# Altium schematic sheet JETSON.SchDoc
size D; SheetNumber: 2; SheetTotal: 8
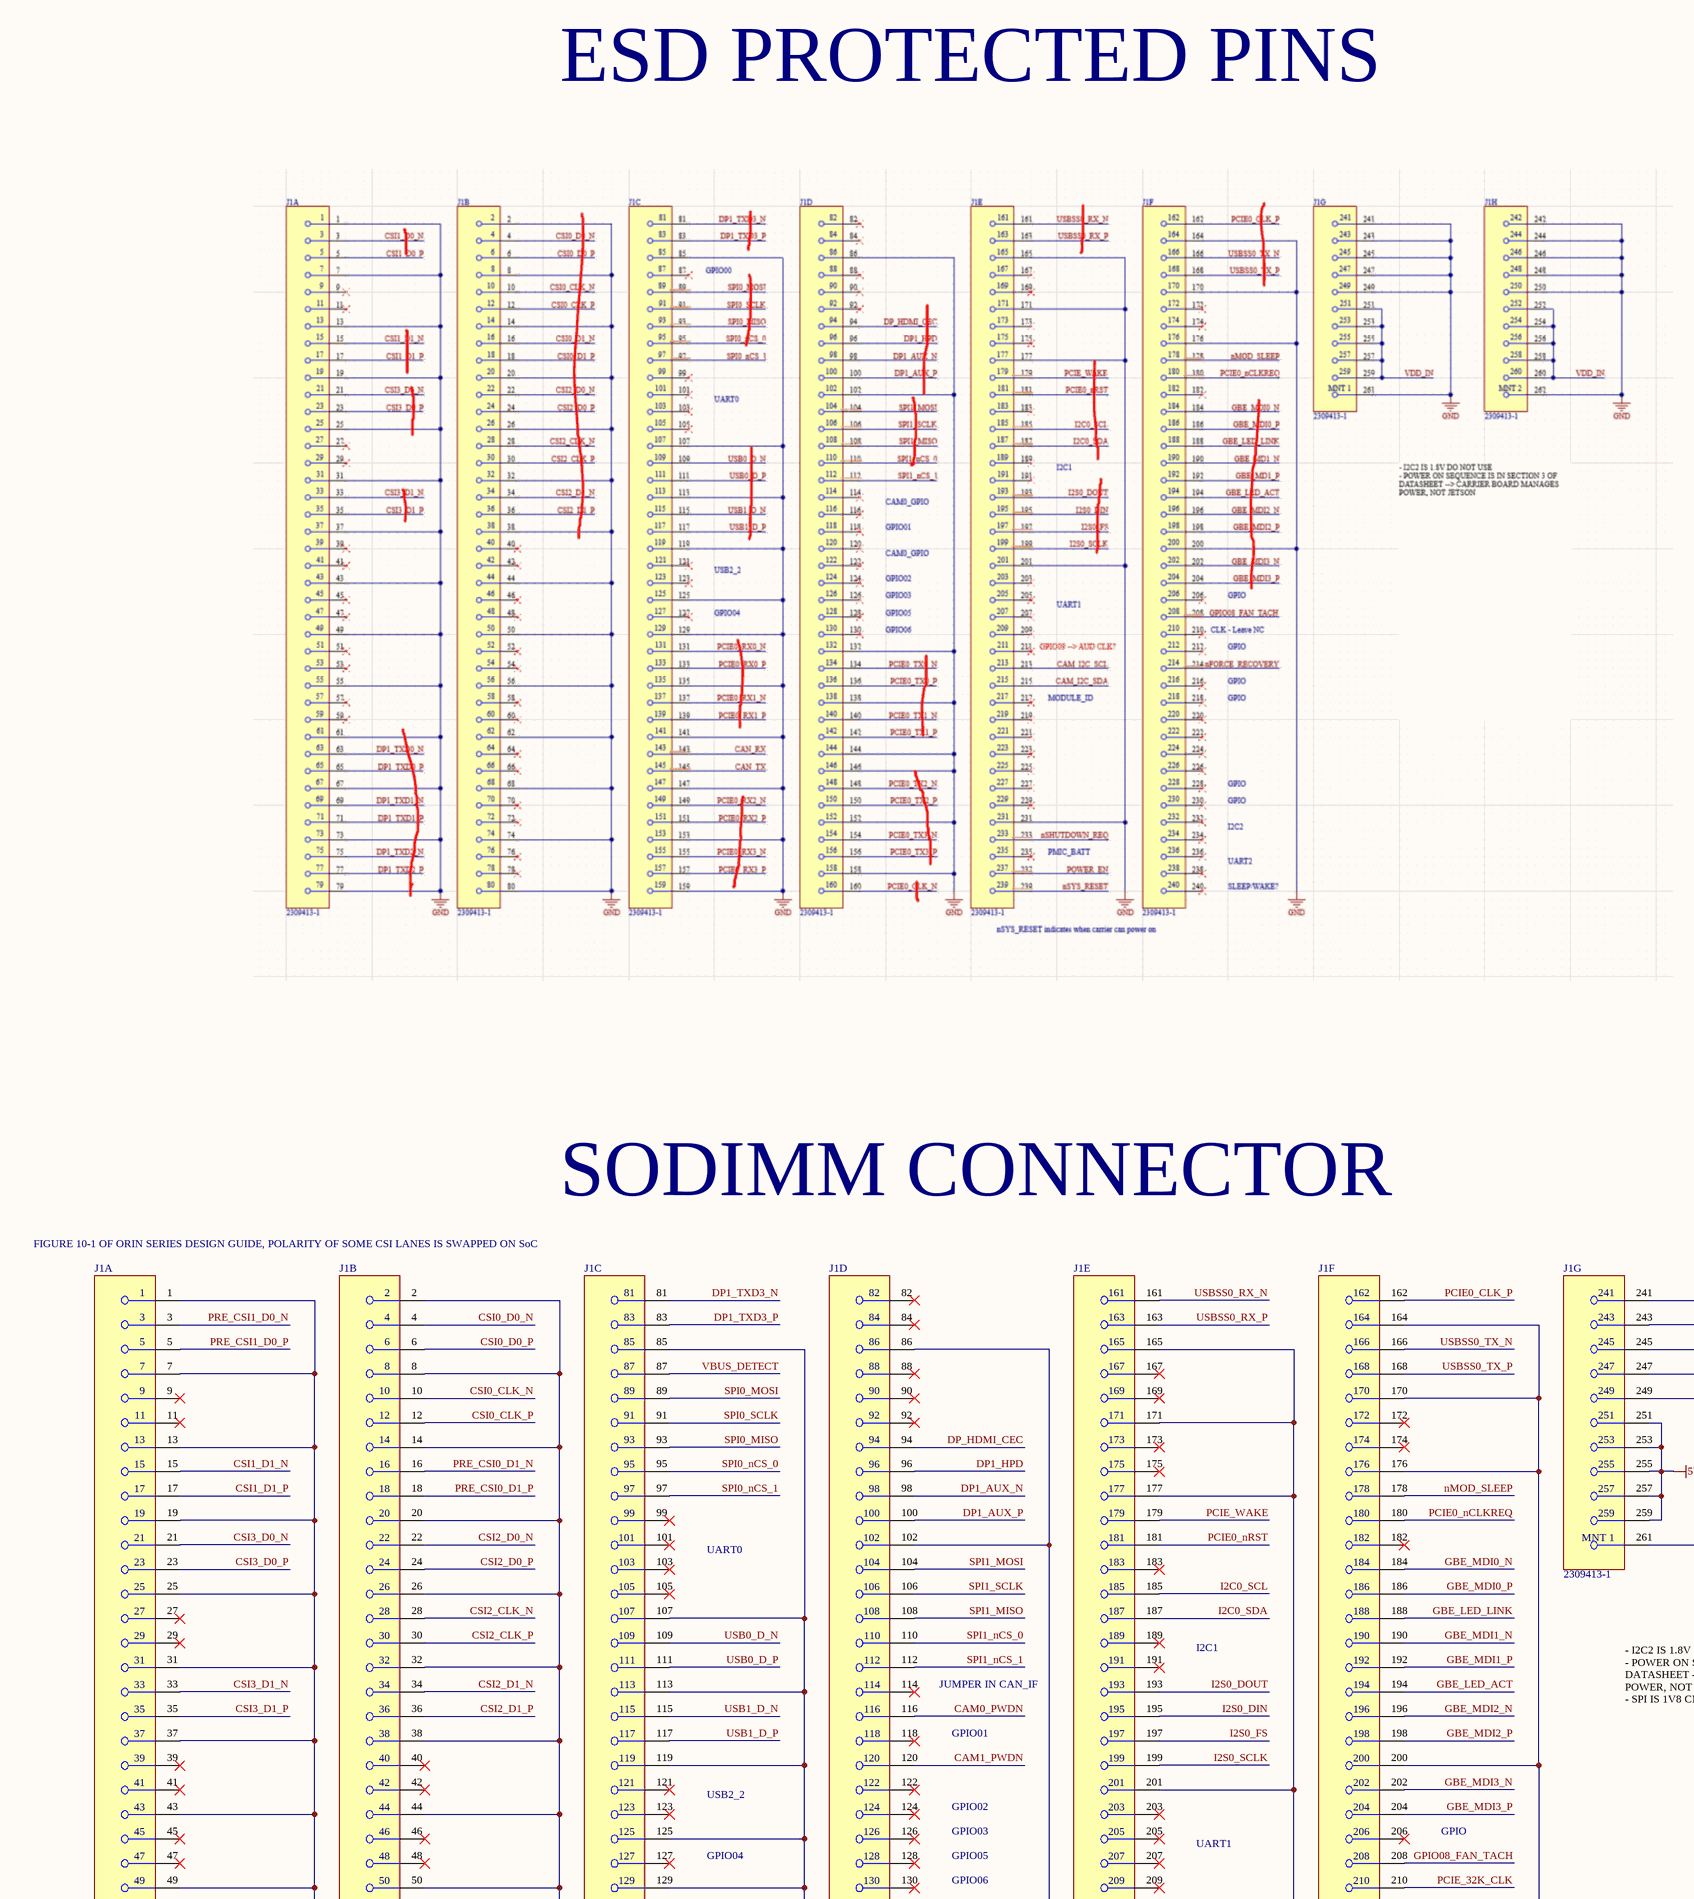
[diagram p0: JETSON.SchDoc, top left]
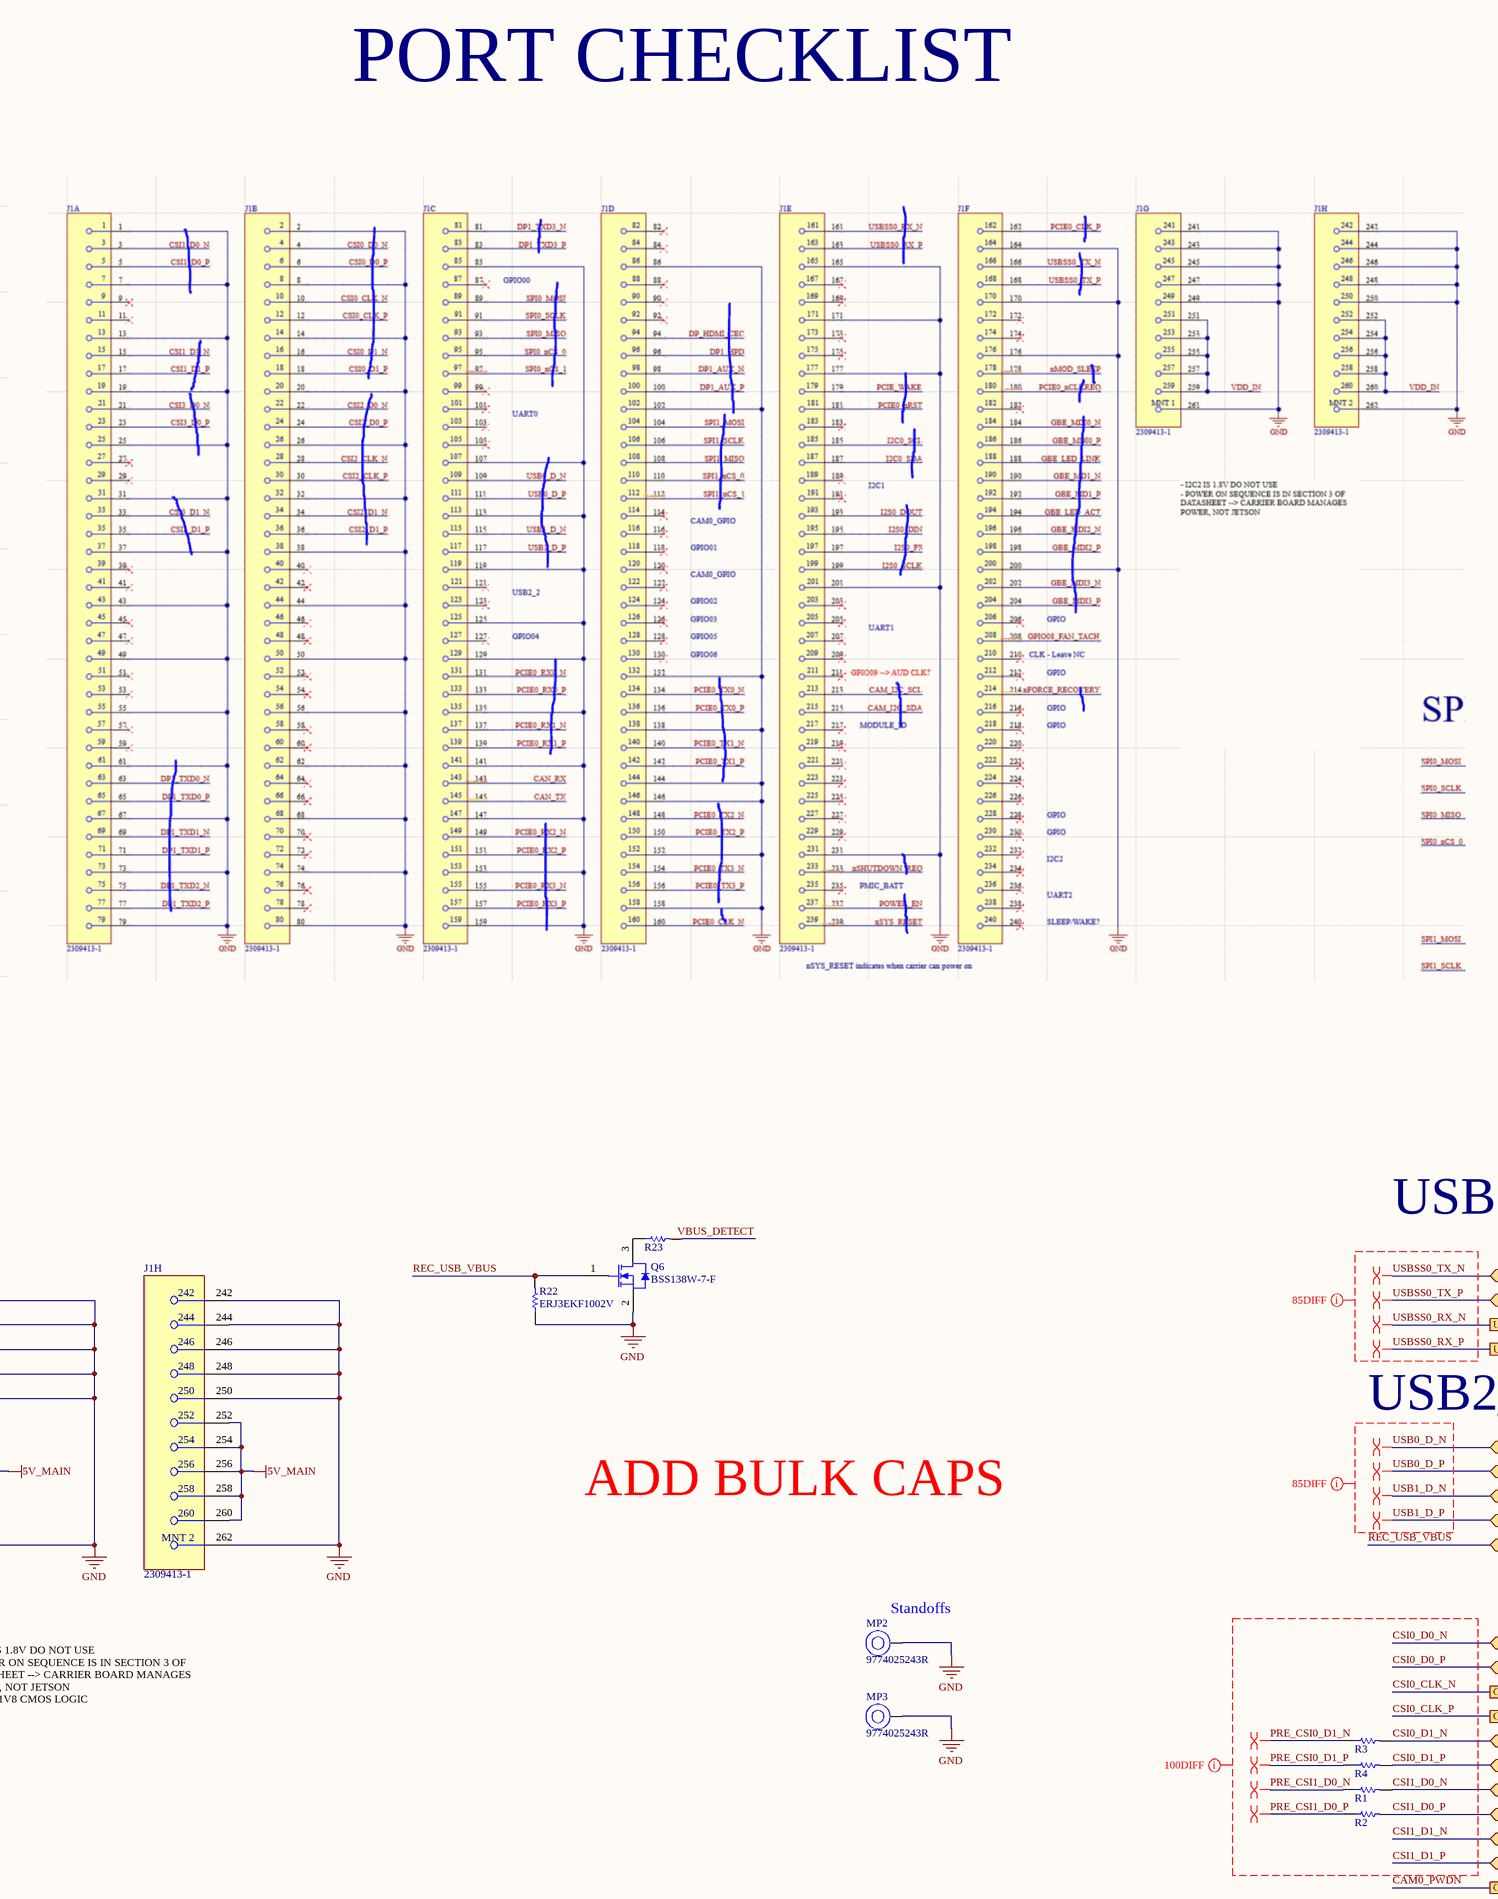
[diagram p1: JETSON.SchDoc, top middle]
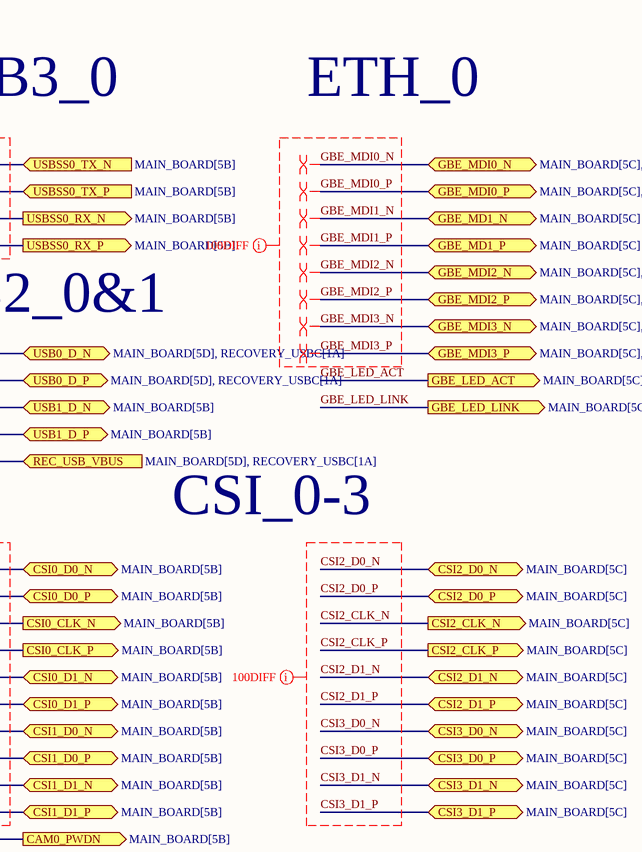
[diagram p2: JETSON.SchDoc, top right]
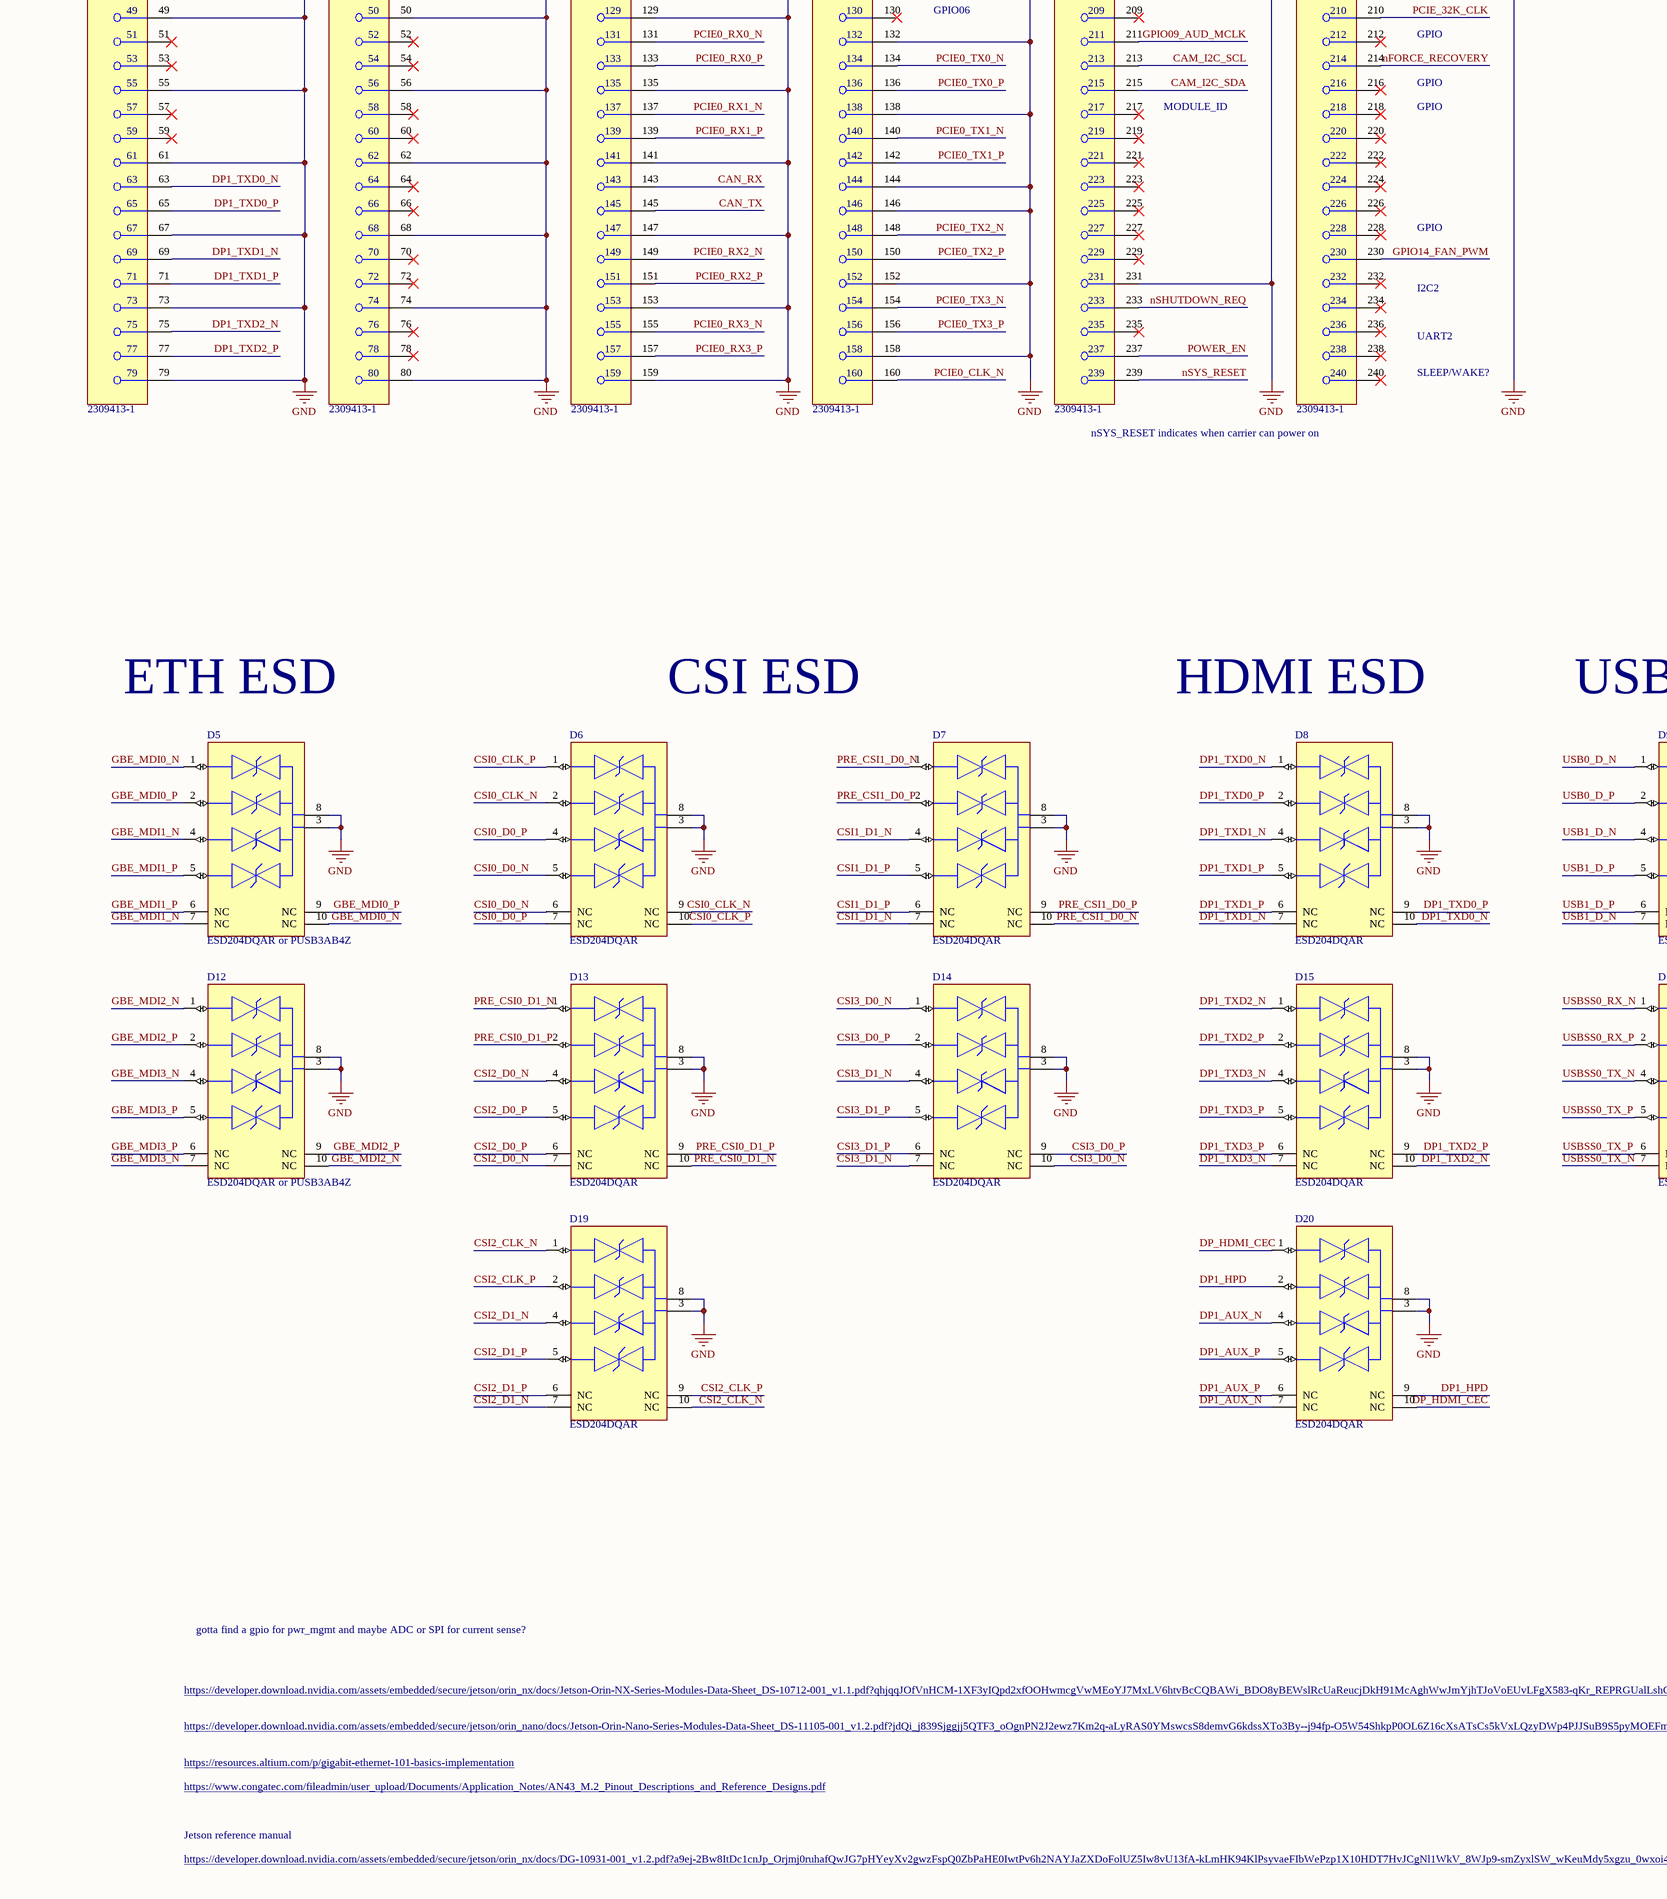
[diagram p3: JETSON.SchDoc, bottom left]
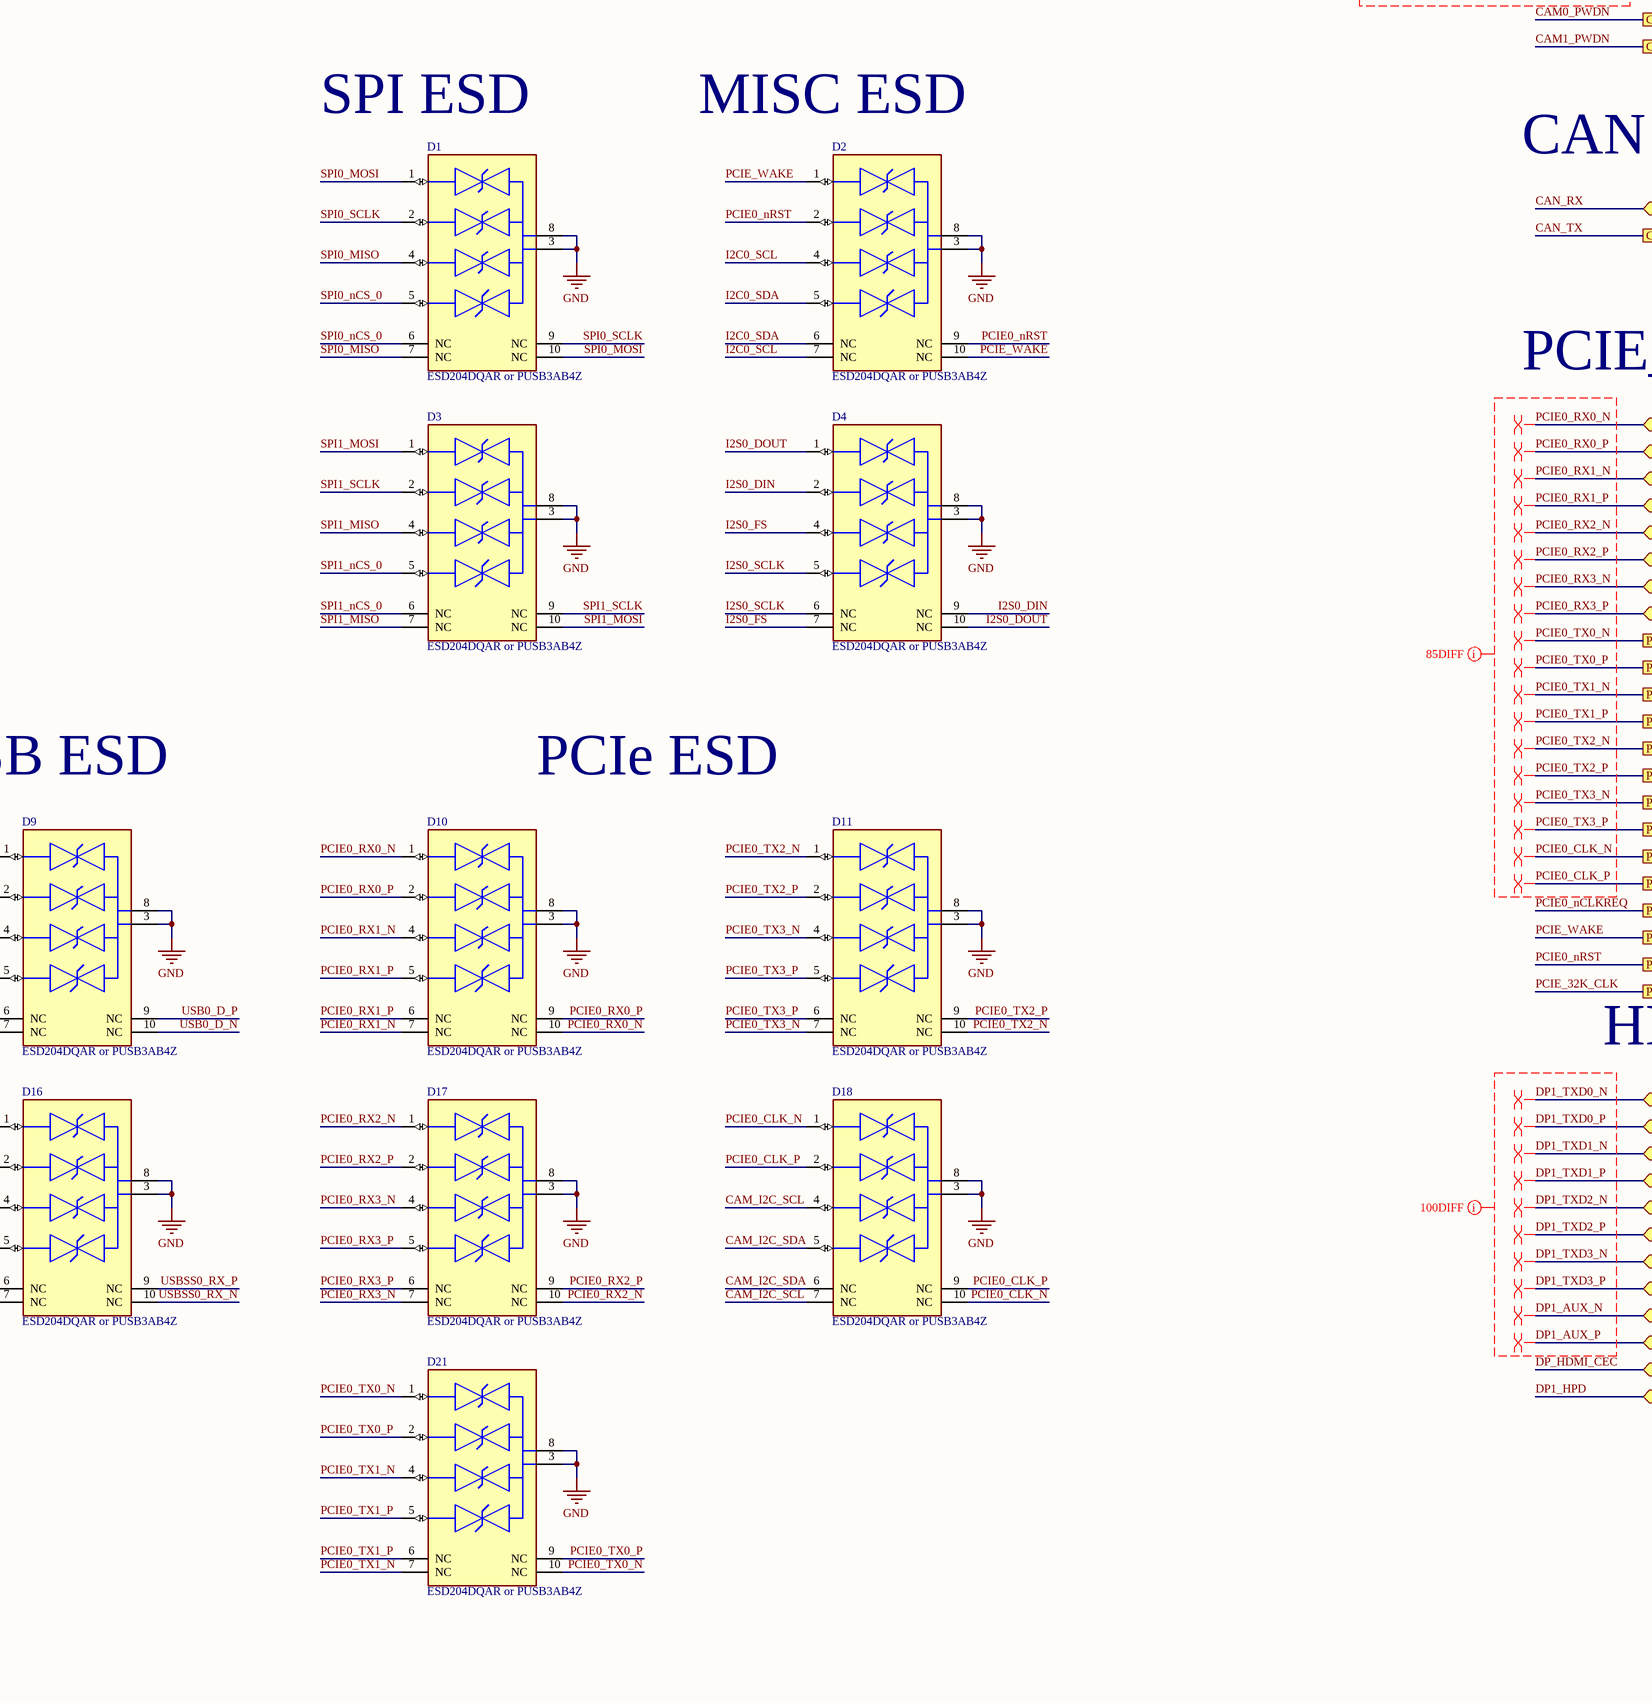
[diagram p4: JETSON.SchDoc, bottom middle]
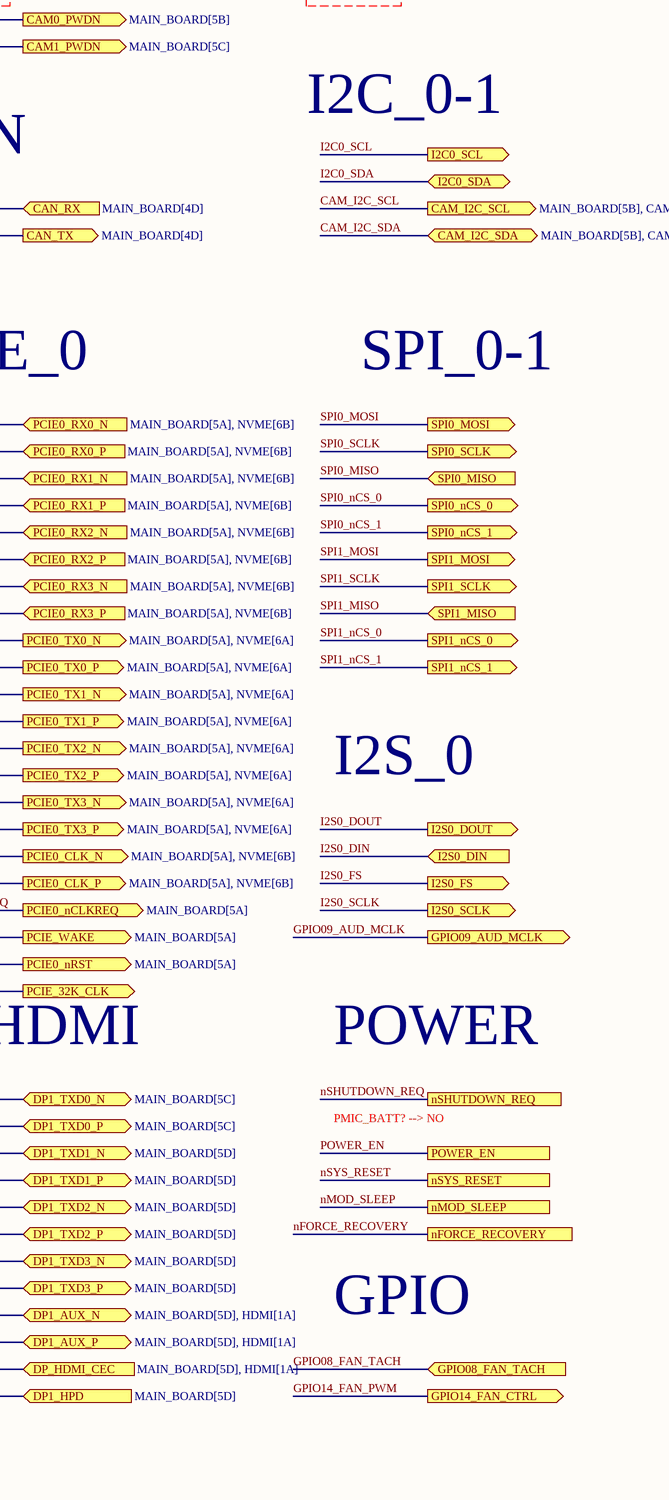
[diagram p5: JETSON.SchDoc, bottom right]

## Parts
D1  ESD204DQAR or PUSB3AB4Z  [FP-DQA0010A-MFG]
D2  ESD204DQAR or PUSB3AB4Z  [FP-DQA0010A-MFG]
D3  ESD204DQAR or PUSB3AB4Z  [FP-DQA0010A-MFG]
D4  ESD204DQAR or PUSB3AB4Z  [FP-DQA0010A-MFG]
D5  ESD204DQAR or PUSB3AB4Z  [FP-DQA0010A-MFG]
D6  ESD204DQAR  [FP-DQA0010A-MFG]
D7  ESD204DQAR  [FP-DQA0010A-MFG]
D8  ESD204DQAR  [FP-DQA0010A-MFG]
D9  ESD204DQAR or PUSB3AB4Z  [FP-DQA0010A-MFG]
D10  ESD204DQAR or PUSB3AB4Z  [FP-DQA0010A-MFG]
D11  ESD204DQAR or PUSB3AB4Z  [FP-DQA0010A-MFG]
D12  ESD204DQAR or PUSB3AB4Z  [FP-DQA0010A-MFG]
D13  ESD204DQAR  [FP-DQA0010A-MFG]
D14  ESD204DQAR  [FP-DQA0010A-MFG]
D15  ESD204DQAR  [FP-DQA0010A-MFG]
D16  ESD204DQAR or PUSB3AB4Z  [FP-DQA0010A-MFG]
D17  ESD204DQAR or PUSB3AB4Z  [FP-DQA0010A-MFG]
D18  ESD204DQAR or PUSB3AB4Z  [FP-DQA0010A-MFG]
D19  ESD204DQAR  [FP-DQA0010A-MFG]
D20  ESD204DQAR  [FP-DQA0010A-MFG]
D21  ESD204DQAR or PUSB3AB4Z  [FP-DQA0010A-MFG]
J1  2309413-1  [FP-2309413-1-MFG]  (parts A,B,C,D,E,F,G,H of 8)
MP2  9774025243R  [9774025243]
MP3  9774025243R  [9774025243]
Q6  BSS138W-7-F  [DIOD-SOT323-3_V]
R1  0402 JUMPER 0 OHM  [RESC1005X40X25NL05T05]  (value not drawn)
R2  0402 JUMPER 0 OHM  [RESC1005X40X25NL05T05]  (value not drawn)
R3  0402 JUMPER 0 OHM  [RESC1005X40X25NL05T05]  (value not drawn)
R4  0402 JUMPER 0 OHM  [RESC1005X40X25NL05T05]  (value not drawn)
R22  ERJ3EKF1002V  [RESC1609X55X30LL15T15]
R23  0402 JUMPER 0 OHM  [RESC1005X40X25NL05T05]  (value not drawn)

## Ports
CAM0_PWDN (out, see MAIN_BOARD[5B]), CAM1_PWDN (out, see MAIN_BOARD[5C]), CAM_I2C_SCL (out, see MAIN_BOARD[5B], CAMERA_INTERFACE[1B]), CAM_I2C_SDA (bidir, see MAIN_BOARD[5B], CAMERA_INTERFACE[1B]), CAN_RX (in, see MAIN_BOARD[4D]), CAN_TX (out, see MAIN_BOARD[4D]), CSI0_CLK_N (out, see MAIN_BOARD[5B]), CSI0_CLK_P (out, see MAIN_BOARD[5B]), CSI0_D0_N (bidir, see MAIN_BOARD[5B]), CSI0_D0_P (bidir, see MAIN_BOARD[5B]), CSI0_D1_N (bidir, see MAIN_BOARD[5B]), CSI0_D1_P (bidir, see MAIN_BOARD[5B]), CSI1_D0_N (bidir, see MAIN_BOARD[5B]), CSI1_D0_P (bidir, see MAIN_BOARD[5B]), CSI1_D1_N (bidir, see MAIN_BOARD[5B]), CSI1_D1_P (bidir, see MAIN_BOARD[5B]), CSI2_CLK_N (out, see MAIN_BOARD[5C]), CSI2_CLK_P (out, see MAIN_BOARD[5C]), CSI2_D0_N (bidir, see MAIN_BOARD[5C]), CSI2_D0_P (bidir, see MAIN_BOARD[5C]), CSI2_D1_N (bidir, see MAIN_BOARD[5C]), CSI2_D1_P (bidir, see MAIN_BOARD[5C]), CSI3_D0_N (bidir, see MAIN_BOARD[5C]), CSI3_D0_P (bidir, see MAIN_BOARD[5C]), CSI3_D1_N (bidir, see MAIN_BOARD[5C]), CSI3_D1_P (bidir, see MAIN_BOARD[5C]), DP1_AUX_N (bidir, see MAIN_BOARD[5D], HDMI[1A]), DP1_AUX_P (bidir, see MAIN_BOARD[5D], HDMI[1A]), DP1_HPD (in, see MAIN_BOARD[5D]), DP1_TXD0_N (bidir, see MAIN_BOARD[5C]), DP1_TXD0_P (bidir, see MAIN_BOARD[5C]), DP1_TXD1_N (bidir, see MAIN_BOARD[5D]), DP1_TXD1_P (bidir, see MAIN_BOARD[5D]), DP1_TXD2_N (bidir, see MAIN_BOARD[5D]), DP1_TXD2_P (bidir, see MAIN_BOARD[5D]), DP1_TXD3_N (bidir, see MAIN_BOARD[5D]), DP1_TXD3_P (bidir, see MAIN_BOARD[5D]), DP_HDMI_CEC (in, see MAIN_BOARD[5D], HDMI[1A]), GBE_LED_ACT (out, see MAIN_BOARD[5C], ETHERNET[1B]), GBE_LED_LINK (out, see MAIN_BOARD[5C], ETHERNET[1B]), GBE_MD1_N (bidir, see MAIN_BOARD[5C]), GBE_MD1_P (bidir, see MAIN_BOARD[5C]), GBE_MDI0_N (bidir, see MAIN_BOARD[5C], ETHERNET[1A]), GBE_MDI0_P (bidir, see MAIN_BOARD[5C], ETHERNET[1A]), GBE_MDI2_N (bidir, see MAIN_BOARD[5C], ETHERNET[1A]), GBE_MDI2_P (bidir, see MAIN_BOARD[5C], ETHERNET[1A]), GBE_MDI3_N (bidir, see MAIN_BOARD[5C], ETHERNET[1B]), GBE_MDI3_P (bidir, see MAIN_BOARD[5C], ETHERNET[1A]), GPIO08_FAN_TACH (in), GPIO09_AUD_MCLK (out), GPIO14_FAN_CTRL (out), I2C0_SCL (out), I2C0_SDA (bidir), I2S0_DIN (in), I2S0_DOUT (out), I2S0_FS (out), I2S0_SCLK (out), nFORCE_RECOVERY, nMOD_SLEEP, nSHUTDOWN_REQ, nSYS_RESET, PCIE0_CLK_N (out, see MAIN_BOARD[5A], NVME[6B]), PCIE0_CLK_P (out, see MAIN_BOARD[5A], NVME[6B]), PCIE0_nCLKREQ (out, see MAIN_BOARD[5A]), PCIE0_nRST (out, see MAIN_BOARD[5A]), PCIE0_RX0_N (in, see MAIN_BOARD[5A], NVME[6B]), PCIE0_RX0_P (in, see MAIN_BOARD[5A], NVME[6B]), PCIE0_RX1_N (in, see MAIN_BOARD[5A], NVME[6B]), PCIE0_RX1_P (in, see MAIN_BOARD[5A], NVME[6B]), PCIE0_RX2_N (in, see MAIN_BOARD[5A], NVME[6B]), PCIE0_RX2_P (in, see MAIN_BOARD[5A], NVME[6B]), PCIE0_RX3_N (in, see MAIN_BOARD[5A], NVME[6B]), PCIE0_RX3_P (in, see MAIN_BOARD[5A], NVME[6B]), PCIE0_TX0_N (out, see MAIN_BOARD[5A], NVME[6A]), PCIE0_TX0_P (out, see MAIN_BOARD[5A], NVME[6A]), PCIE0_TX1_N (out, see MAIN_BOARD[5A], NVME[6A]), PCIE0_TX1_P (out, see MAIN_BOARD[5A], NVME[6A]), PCIE0_TX2_N (out, see MAIN_BOARD[5A], NVME[6A]), PCIE0_TX2_P (out, see MAIN_BOARD[5A], NVME[6A]), PCIE0_TX3_N (out, see MAIN_BOARD[5A], NVME[6A]), PCIE0_TX3_P (out, see MAIN_BOARD[5A], NVME[6A]), PCIE_32K_CLK (out), PCIE_WAKE (out, see MAIN_BOARD[5A]), POWER_EN, REC_USB_VBUS (in, see MAIN_BOARD[5D], RECOVERY_USBC[1A]), SPI0_MISO (in), SPI0_MOSI (out), SPI0_nCS_0 (out), SPI0_nCS_1 (out), SPI0_SCLK (out), SPI1_MISO (in), SPI1_MOSI (out), SPI1_nCS_0 (out), SPI1_nCS_1 (out), SPI1_SCLK (out), USB0_D_N (bidir, see MAIN_BOARD[5D], RECOVERY_USBC[1A]), USB0_D_P (bidir, see MAIN_BOARD[5D], RECOVERY_USBC[1A]), USB1_D_N (bidir, see MAIN_BOARD[5B]), USB1_D_P (bidir, see MAIN_BOARD[5B]), USBSS0_RX_N (out, see MAIN_BOARD[5B]), USBSS0_RX_P (out, see MAIN_BOARD[5B]), USBSS0_TX_N (in, see MAIN_BOARD[5B]), USBSS0_TX_P (in, see MAIN_BOARD[5B])

## Nets
5V_MAIN: J1.251 J1.252 J1.253 J1.254 J1.255 J1.256 J1.257 J1.258 J1.259 J1.260
GND: D1.3(GND) D1.8(GND) D2.3(GND) D2.8(GND) D3.3(GND) D3.8(GND) D4.3(GND) D4.8(GND) D5.3(GND) D5.8(GND) D6.3(GND) D6.8(GND) D7.3(GND) D7.8(GND) D8.3(GND) D8.8(GND) D9.3(GND) D9.8(GND) D10.3(GND) D10.8(GND) D11.3(GND) D11.8(GND) D12.3(GND) D12.8(GND) D13.3(GND) D13.8(GND) D14.3(GND) D14.8(GND) D15.3(GND) D15.8(GND) D16.3(GND) D16.8(GND) D17.3(GND) D17.8(GND) D18.3(GND) D18.8(GND) D19.3(GND) D19.8(GND) D20.3(GND) D20.8(GND) D21.3(GND) D21.8(GND) J1.1 J1.2 J1.7 J1.8 J1.13 J1.14 J1.19 J1.20 J1.25 J1.26 J1.31 J1.32 J1.37 J1.38 J1.43 J1.44 J1.49 J1.50 J1.55 J1.56 J1.61 J1.62 J1.67 J1.68 J1.73 J1.74 J1.79 J1.80 J1.85 J1.86 J1.102 J1.107 J1.113 J1.119 J1.125 J1.129 J1.132 J1.135 J1.138 J1.141 J1.144 J1.146 J1.147 J1.152 J1.153 J1.158 J1.159 J1.164 J1.165 J1.170 J1.171 J1.176 J1.177 J1.200 J1.201 J1.231 J1.241 J1.242 J1.243 J1.244 J1.245 J1.246 J1.247 J1.248 J1.249 J1.250 J1.261(MNT_1) J1.262(MNT_2) MP2.1 MP3.1 Q6.2(S) R22.1
CAM0_PWDN: J1.116 ; port CAM0_PWDN
CAM1_PWDN: J1.120 ; port CAM1_PWDN
CAM_I2C_SCL: D18.4(IO3) D18.7(NC) J1.213 ; port CAM_I2C_SCL
CAM_I2C_SDA: D18.5(IO4) D18.6(NC) J1.215 ; port CAM_I2C_SDA
CAN_RX: J1.143 ; port CAN_RX
CAN_TX: J1.145 ; port CAN_TX
CSI0_CLK_N: D6.2(IO2) D6.9(NC) J1.10 ; port CSI0_CLK_N
CSI0_CLK_P: D6.1(IO1) D6.10(NC) J1.12 ; port CSI0_CLK_P
CSI0_D0_N: D6.5(IO4) D6.6(NC) J1.4 ; port CSI0_D0_N
CSI0_D0_P: D6.4(IO3) D6.7(NC) J1.6 ; port CSI0_D0_P
CSI0_D1_N: R3.2 ; port CSI0_D1_N
CSI0_D1_P: R4.2 ; port CSI0_D1_P
CSI1_D0_N: R1.2 ; port CSI1_D0_N
CSI1_D0_P: R2.2 ; port CSI1_D0_P
CSI1_D1_N: D7.4(IO3) D7.7(NC) J1.15 ; port CSI1_D1_N
CSI1_D1_P: D7.5(IO4) D7.6(NC) J1.17 ; port CSI1_D1_P
CSI2_CLK_N: D19.1(IO1) D19.10(NC) J1.28 ; port CSI2_CLK_N
CSI2_CLK_P: D19.2(IO2) D19.9(NC) J1.30 ; port CSI2_CLK_P
CSI2_D0_N: D13.4(IO3) D13.7(NC) J1.22 ; port CSI2_D0_N
CSI2_D0_P: D13.5(IO4) D13.6(NC) J1.24 ; port CSI2_D0_P
CSI2_D1_N: D19.4(IO3) D19.7(NC) J1.34 ; port CSI2_D1_N
CSI2_D1_P: D19.5(IO4) D19.6(NC) J1.36 ; port CSI2_D1_P
CSI3_D0_N: D14.1(IO1) D14.10(NC) J1.21 ; port CSI3_D0_N
CSI3_D0_P: D14.2(IO2) D14.9(NC) J1.23 ; port CSI3_D0_P
CSI3_D1_N: D14.4(IO3) D14.7(NC) J1.33 ; port CSI3_D1_N
CSI3_D1_P: D14.5(IO4) D14.6(NC) J1.35 ; port CSI3_D1_P
DP1_AUX_N: D20.4(IO3) D20.7(NC) J1.98 ; port DP1_AUX_N
DP1_AUX_P: D20.5(IO4) D20.6(NC) J1.100 ; port DP1_AUX_P
DP1_HPD: D20.2(IO2) D20.9(NC) J1.96 ; port DP1_HPD
DP1_TXD0_N: D8.1(IO1) D8.10(NC) J1.63 ; port DP1_TXD0_N
DP1_TXD0_P: D8.2(IO2) D8.9(NC) J1.65 ; port DP1_TXD0_P
DP1_TXD1_N: D8.4(IO3) D8.7(NC) J1.69 ; port DP1_TXD1_N
DP1_TXD1_P: D8.5(IO4) D8.6(NC) J1.71 ; port DP1_TXD1_P
DP1_TXD2_N: D15.1(IO1) D15.10(NC) J1.75 ; port DP1_TXD2_N
DP1_TXD2_P: D15.2(IO2) D15.9(NC) J1.77 ; port DP1_TXD2_P
DP1_TXD3_N: D15.4(IO3) D15.7(NC) J1.81 ; port DP1_TXD3_N
DP1_TXD3_P: D15.5(IO4) D15.6(NC) J1.83 ; port DP1_TXD3_P
DP_HDMI_CEC: D20.1(IO1) D20.10(NC) J1.94 ; port DP_HDMI_CEC
GBE_LED_ACT: J1.194 ; port GBE_LED_ACT
GBE_LED_LINK: J1.188 ; port GBE_LED_LINK
GBE_MDI0_N: D5.1(IO1) D5.10(NC) J1.184 ; port GBE_MDI0_N
GBE_MDI0_P: D5.2(IO2) D5.9(NC) J1.186 ; port GBE_MDI0_P
GBE_MDI1_N: D5.4(IO3) D5.7(NC) J1.190 ; port GBE_MD1_N
GBE_MDI1_P: D5.5(IO4) D5.6(NC) J1.192 ; port GBE_MD1_P
GBE_MDI2_N: D12.1(IO1) D12.10(NC) J1.196 ; port GBE_MDI2_N
GBE_MDI2_P: D12.2(IO2) D12.9(NC) J1.198 ; port GBE_MDI2_P
GBE_MDI3_N: D12.4(IO3) D12.7(NC) J1.202 ; port GBE_MDI3_N
GBE_MDI3_P: D12.5(IO4) D12.6(NC) J1.204 ; port GBE_MDI3_P
GPIO08_FAN_TACH: J1.208 ; port GPIO08_FAN_TACH
GPIO09_AUD_MCLK: J1.211 ; port GPIO09_AUD_MCLK
GPIO14_FAN_PWM: J1.230 ; port GPIO14_FAN_CTRL
I2C0_SCL: D2.4(IO3) D2.7(NC) J1.185 ; port I2C0_SCL
I2C0_SDA: D2.5(IO4) D2.6(NC) J1.187 ; port I2C0_SDA
I2S0_DIN: D4.2(IO2) D4.9(NC) J1.195 ; port I2S0_DIN
I2S0_DOUT: D4.1(IO1) D4.10(NC) J1.193 ; port I2S0_DOUT
I2S0_FS: D4.4(IO3) D4.7(NC) J1.197 ; port I2S0_FS
I2S0_SCLK: D4.5(IO4) D4.6(NC) J1.199 ; port I2S0_SCLK
nFORCE_RECOVERY: J1.214 ; port nFORCE_RECOVERY
nMOD_SLEEP: J1.178 ; port nMOD_SLEEP
nSHUTDOWN_REQ: J1.233 ; port nSHUTDOWN_REQ
nSYS_RESET: J1.239 ; port nSYS_RESET
PCIE0_CLK_N: D18.1(IO1) D18.10(NC) J1.160 ; port PCIE0_CLK_N
PCIE0_CLK_P: D18.2(IO2) D18.9(NC) J1.162 ; port PCIE0_CLK_P
PCIE0_nCLKREQ: J1.180 ; port PCIE0_nCLKREQ
PCIE0_nRST: D2.2(IO2) D2.9(NC) J1.181 ; port PCIE0_nRST
PCIE0_RX0_N: D10.1(IO1) D10.10(NC) J1.131 ; port PCIE0_RX0_N
PCIE0_RX0_P: D10.2(IO2) D10.9(NC) J1.133 ; port PCIE0_RX0_P
PCIE0_RX1_N: D10.4(IO3) D10.7(NC) J1.137 ; port PCIE0_RX1_N
PCIE0_RX1_P: D10.5(IO4) D10.6(NC) J1.139 ; port PCIE0_RX1_P
PCIE0_RX2_N: D17.1(IO1) D17.10(NC) J1.149 ; port PCIE0_RX2_N
PCIE0_RX2_P: D17.2(IO2) D17.9(NC) J1.151 ; port PCIE0_RX2_P
PCIE0_RX3_N: D17.4(IO3) D17.7(NC) J1.155 ; port PCIE0_RX3_N
PCIE0_RX3_P: D17.5(IO4) D17.6(NC) J1.157 ; port PCIE0_RX3_P
PCIE0_TX0_N: D21.1(IO1) D21.10(NC) J1.134 ; port PCIE0_TX0_N
PCIE0_TX0_P: D21.2(IO2) D21.9(NC) J1.136 ; port PCIE0_TX0_P
PCIE0_TX1_N: D21.4(IO3) D21.7(NC) J1.140 ; port PCIE0_TX1_N
PCIE0_TX1_P: D21.5(IO4) D21.6(NC) J1.142 ; port PCIE0_TX1_P
PCIE0_TX2_N: D11.1(IO1) D11.10(NC) J1.148 ; port PCIE0_TX2_N
PCIE0_TX2_P: D11.2(IO2) D11.9(NC) J1.150 ; port PCIE0_TX2_P
PCIE0_TX3_N: D11.4(IO3) D11.7(NC) J1.154 ; port PCIE0_TX3_N
PCIE0_TX3_P: D11.5(IO4) D11.6(NC) J1.156 ; port PCIE0_TX3_P
PCIE_32K_CLK: J1.210 ; port PCIE_32K_CLK
PCIE_WAKE: D2.1(IO1) D2.10(NC) J1.179 ; port PCIE_WAKE
POWER_EN: J1.237 ; port POWER_EN
PRE_CSI0_D1_N: D13.1(IO1) D13.10(NC) J1.16 R3.1
PRE_CSI0_D1_P: D13.2(IO2) D13.9(NC) J1.18 R4.1
PRE_CSI1_D0_N: D7.1(IO1) D7.10(NC) J1.3 R1.1
PRE_CSI1_D0_P: D7.2(IO2) D7.9(NC) J1.5 R2.1
REC_USB_VBUS: Q6.1(G) R22.2 ; port REC_USB_VBUS
SPI0_MISO: D1.4(IO3) D1.7(NC) J1.93 ; port SPI0_MISO
SPI0_MOSI: D1.1(IO1) D1.10(NC) J1.89 ; port SPI0_MOSI
SPI0_nCS_0: D1.5(IO4) D1.6(NC) J1.95 ; port SPI0_nCS_0
SPI0_nCS_1: J1.97 ; port SPI0_nCS_1
SPI0_SCLK: D1.2(IO2) D1.9(NC) J1.91 ; port SPI0_SCLK
SPI1_MISO: D3.4(IO3) D3.7(NC) J1.108 ; port SPI1_MISO
SPI1_MOSI: D3.1(IO1) D3.10(NC) J1.104 ; port SPI1_MOSI
SPI1_nCS_0: D3.5(IO4) D3.6(NC) J1.110 ; port SPI1_nCS_0
SPI1_nCS_1: J1.112 ; port SPI1_nCS_1
SPI1_SCLK: D3.2(IO2) D3.9(NC) J1.106 ; port SPI1_SCLK
USB0_D_N: D9.1(IO1) D9.10(NC) J1.109 ; port USB0_D_N
USB0_D_P: D9.2(IO2) D9.9(NC) J1.111 ; port USB0_D_P
USB1_D_N: D9.4(IO3) D9.7(NC) J1.115 ; port USB1_D_N
USB1_D_P: D9.5(IO4) D9.6(NC) J1.117 ; port USB1_D_P
USBSS0_RX_N: D16.1(IO1) D16.10(NC) J1.161 ; port USBSS0_RX_N
USBSS0_RX_P: D16.2(IO2) D16.9(NC) J1.163 ; port USBSS0_RX_P
USBSS0_TX_N: D16.4(IO3) D16.7(NC) J1.166 ; port USBSS0_TX_N
USBSS0_TX_P: D16.5(IO4) D16.6(NC) J1.168 ; port USBSS0_TX_P
VBUS_DETECT: J1.87 R23.2
NetQ6_3: Q6.3(D) R23.1

Not connected (* = marked no-connect by the designer): J1 9* 11* 27* 29* 39* 40* 41* 42* 45* 46* 47* 48* 51* 52* 53* 54* 57* 58* 59* 60* 64* 66* 70* 72* 76* 78* 82* 84* 88* 90* 92* 99* 101* 103* 105* 114* 118* 121* 122* 123* 124* 126* 127* 128* 130* 167* 169* 172* 173* 174* 175* 182* 183* 189* 191* 203* 205* 206* 207* 209* 212* 216* 217* 218* 219* 220* 221* 222* 223* 224* 225* 226* 227* 228* 229* 232* 234* 235* 236* 238* 240*

## Layout directives
net class 85DIFF: PCIE0_CLK_N, PCIE0_CLK_P, PCIE0_RX0_N, PCIE0_RX0_P, PCIE0_RX1_N, PCIE0_RX1_P, PCIE0_RX2_N, PCIE0_RX2_P, PCIE0_RX3_N, PCIE0_RX3_P, PCIE0_TX0_N, PCIE0_TX0_P, PCIE0_TX1_N, PCIE0_TX1_P, PCIE0_TX2_N, PCIE0_TX2_P, PCIE0_TX3_N, PCIE0_TX3_P, USB0_D_N, USB0_D_P, USB1_D_N, USB1_D_P, USBSS0_RX_N, USBSS0_RX_P, USBSS0_TX_N, USBSS0_TX_P
net class 100DIFF: CSI0_CLK_N, CSI0_CLK_P, CSI0_D0_N, CSI0_D0_P, CSI0_D1_N, CSI0_D1_P, CSI1_D0_N, CSI1_D0_P, CSI1_D1_N, CSI1_D1_P, CSI2_CLK_N, CSI2_CLK_P, CSI2_D0_N, CSI2_D0_P, CSI2_D1_N, CSI2_D1_P, CSI3_D0_N, CSI3_D0_P, CSI3_D1_N, CSI3_D1_P, DP1_AUX_N, DP1_AUX_P, DP1_TXD0_N, DP1_TXD0_P, DP1_TXD1_N, DP1_TXD1_P, DP1_TXD2_N, DP1_TXD2_P, DP1_TXD3_N, DP1_TXD3_P, GBE_MDI0_N, GBE_MDI0_P, GBE_MDI1_N, GBE_MDI1_P, GBE_MDI2_N, GBE_MDI2_P, GBE_MDI3_N, GBE_MDI3_P, PRE_CSI0_D1_N, PRE_CSI0_D1_P, PRE_CSI1_D0_N, PRE_CSI1_D0_P
differential pair: DP1_AUX_N, DP1_AUX_P, DP1_TXD0_N, DP1_TXD0_P, DP1_TXD1_N, DP1_TXD1_P, DP1_TXD2_N, DP1_TXD2_P, DP1_TXD3_N, DP1_TXD3_P, GBE_MDI0_N, GBE_MDI0_P, GBE_MDI1_N, GBE_MDI1_P, GBE_MDI2_N, GBE_MDI2_P, GBE_MDI3_N, GBE_MDI3_P, PCIE0_CLK_N, PCIE0_CLK_P, PCIE0_RX0_N, PCIE0_RX0_P, PCIE0_RX1_N, PCIE0_RX1_P, PCIE0_RX2_N, PCIE0_RX2_P, PCIE0_RX3_N, PCIE0_RX3_P, PCIE0_TX0_N, PCIE0_TX0_P, PCIE0_TX1_N, PCIE0_TX1_P, PCIE0_TX2_N, PCIE0_TX2_P, PCIE0_TX3_N, PCIE0_TX3_P, PRE_CSI0_D1_N, PRE_CSI0_D1_P, PRE_CSI1_D0_N, PRE_CSI1_D0_P, USB0_D_N, USB0_D_P, USB1_D_N, USB1_D_P, USBSS0_RX_N, USBSS0_RX_P, USBSS0_TX_N, USBSS0_TX_P

## Notes on the sheet
- ESD PROTECTED PINS
- PORT CHECKLIST
- SODIMM CONNECTOR
- USB3_0
- ETH_0
- FIGURE 10-1 OF ORIN SERIES DESIGN GUIDE, POLARITY OF SOME CSI LANES IS SWAPPED ON SoC
- USB2_0&1
- ADD BULK CAPS
- UART0
- CSI_0-3
- I2C1
- (near MP2) Standoffs
- JUMPER IN CAN_IF
- GPIO01
- USB2_2
- GPIO02
- GPIO03
- UART1
- GPIO
- GPIO04
- GPIO05
- GPIO06
- MODULE_ID
- - I2C2 IS 1.8V DO NOT USE
  - POWER ON SEQUENCE IS IN SECTION 3 OF DATASHEET --> CARRIER BOARD MANAGES POWER, NOT JETSON
  - SPI IS 1V8 CMOS LOGIC
- SPI ESD
- MISC ESD
- CAN
- I2C_0-1
- I2C2
- UART2
- PCIE_0
- SPI_0-1
- SLEEP/WAKE?
- nSYS_RESET indicates when carrier can power on
- ETH ESD
- CSI ESD
- HDMI ESD
- USB ESD
- PCIe ESD
- I2S_0
- HDMI
- POWER
- PMIC_BATT? --> NO
- gotta find a gpio for pwr_mgmt and maybe ADC or SPI for current sense?
- https://developer.download.nvidia.com/assets/embedded/secure/jetson/orin_nx/docs/Jetson-Orin-NX-Series-Modules-Data-Sheet_DS-10712-001_v1.1.pdf?qhjqqJOfVnHCM-1XF3yIQpd2xfOOHwmcgVwMEoYJ7MxLV6htvBcCQBAWi_BDO8yBEWslRcUaReucjDkH91McAghWwJmYjhTJoVoEUvLFgX583-qKr_REPRGUalLshQ-DeOK5XvySH5OmW4RDnQayRqIhzIBBSUWPjFaWLdJjM1JhWiyI3hM5VtWcQCIuw7hGP4sJ7ZLCMgQXeMz6eFhUxr5xiOQPPyQ1&t=eyJscyI6ImdzZW8iLCJsc2QiOiJodHRwczovL3d3dy5nb29nbGUuY29tLyJ9
- https://developer.download.nvidia.com/assets/embedded/secure/jetson/orin_nano/docs/Jetson-Orin-Nano-Series-Modules-Data-Sheet_DS-11105-001_v1.2.pdf?jdQi_j839Sjggjj5QTF3_oOgnPN2J2ewz7Km2q-aLyRAS0YMswcsS8demvG6kdssXTo3By--j94fp-O5W54ShkpP0OL6Z16cXsATsCs5kVxLQzyDWp4PJJSuB9S5pyMOEFmtw_tlPL_Gy2oPuhK_UbNdkrgh1dCA55zEuK928asFQhAHapZ0s__KiE7erU3EBWJIZ94vBC5BwytStbskK9hDtogPdFhuGCQNTg==&t=eyJscyI6ImdzZW8iLCJsc2QiOiJodHRwczovL3d3dy5nb29nbGUuY29tLyJ9
- https://resources.altium.com/p/gigabit-ethernet-101-basics-implementation
- https://www.congatec.com/fileadmin/user_upload/Documents/Application_Notes/AN43_M.2_Pinout_Descriptions_and_Reference_Designs.pdf
- Jetson reference manual
- https://developer.download.nvidia.com/assets/embedded/secure/jetson/orin_nx/docs/DG-10931-001_v1.2.pdf?a9ej-2Bw8ItDc1cnJp_Orjmj0ruhafQwJG7pHYeyXv2gwzFspQ0ZbPaHE0IwtPv6h2NAYJaZXDoFolUZ5Iw8vU13fA-kLmHK94KlPsyvaeFIbWePzp1X10HDT7HvJCgNl1WkV_8WJp9-smZyxlSW_wKeuMdy5xgzu_0wxoi4gg==&t=eyJscyI6ImdzZW8iLCJsc2QiOiJodHRwczovL3d3dy5nb29nbGUuY29tLyJ9

## Library data of the parts
D1-D21 = CMP-04989-000002-1: 4-CHANNEL LOW-CAPACITANCE SURGE; Manufacturer: Texas Instruments; Value: 0.55pF; Reverse Standoff Voltage: 3.6V; Standoff Height: 0mm; Breakdown Voltage: 5.5V; Peak Pulse Current: 5.5A; Clamping Voltage: 11.5V; Direction: Bidirectional; Peak Pulse Power: 50W; Number Of Channels: 4; Ambient Temperature Range High: +125°C; ComponentLink2Description: Datasheet; Height: 0.55mm; Lead Free: Yes; Device Class L3: unset; Temperature Range High: +125°C; Temperature Range Low: -40°C; Package: DQA0010A; Temperature: -40°C to +125°C; Capacitance: 0.55pF; RoHS: TRUE; Mouser Description: 4-Channel Low-Capacitance Surge and ESD Protection Diode 10-USON -40 to 125; Category: Diode; Device Class L1: Circuit Protection; Octopart: https://octopart.com/esd204dqar-texas+instruments-89917476; Device Class L2: TVS Diodes; Ambient Temperature Range Low: -40°C; Manufacturer Part Number: ESD204DQAR; ComponentLink2URL: http://www.ti.com/lit/ds/symlink/esd204.pdf; Automotive: No; Digikey Description: 4-CHANNEL LOW-CAPACITANCE SURGE
J1 = CMP-03356-000001-1: DDR4 SODIMM 260P 9.2H STD; Manufacturer: TE Connectivity; Voltage Rating: 25V; Current Rating: 0.5A; Is Female: yes; Pitch: 0.5mm; Memory Type: SDRAM,DDR; Conn Orientation: Horizontal; Number Of Contacts: 260; Temperature: -55°C to +85°C; Octopart: https://octopart.com/2309413-1-te+connectivity-84799194; Device Class L3: unset; Contact Material: Gold,Nickel; ComponentLink2URL: https://www.te.com/commerce/DocumentDelivery/DDEController?Action=showdoc&DocId=Specification+Or+Standard%7F108-115122%7FA1%7Fpdf%7FEnglish%7FENG_SS_108-115122_A1.pdf%7F2309413-1; Manufacturer Part Number: 2309413-1; ComponentLink2Description: Datasheet; Digikey Description: DDR4 SODIMM 260P 9.2H STD; Height: 18.8mm; Footprint Url: https://www.te.com/commerce/DocumentDelivery/DDEController?Action=showdoc&DocId=Customer+Drawing%7F2309413%7F4%7Fpdf%7FEnglish%7FENG_CD_2309413_4.pdf%7F2309413-1; Temperature Range Low: -55°C; Device Class L2: Memory Connectors; Temperature Range High: +85°C; RoHS: TRUE; Automotive: No; Device Class L1: Connectors; Mouser Description: Conn DDR4 DIMM Socket SKT 260 POS 0.5mm Solder RA SMD T/R; Category: Conn; Package: 0; Lead Free: Yes
MP2 MP3 = CMP-03913-59774857-1: 9774025243R Spacer Material: Steel, Tin-Plated Mounting: SMT Series: WA-SMST Thread D: M2; Outside Diameter: 4.3434mm; Threaded/Unthreaded: Threaded; Plating: Tin; REACH SVHC: Unknown; NexarPartId: 59774857; RoHS: Compliant; Material: Steel; Packaging: Tape and Reel; Max Operating Temperature: 150°C; Min Operating Temperature: -55°C; Length: 2.5mm; Height: 2.5mm
Q6 = CMP-2000-05968-1: N-Channel Enhancement Mode Mosfet, 50 V, 200 mA, -55 to 150 degC, 6-Pin SOT-323, RoHS, Tape and Reel; Typical Turn-Off Delay Time: 20ns; Number of Channels: 1Channel; Type: EnhancementModeFieldEffectTransistor; Brand: DiodesIncorporated; Vds - Drain-Source Breakdown Voltage: 75V; Vgs - Gate-Source Voltage: 20V; Rds On - Drain-Source Resistance: 1.4Ohms; Transistor Type: 1N-Channel; Configuration: Single; Unit Weight: 0.000212oz; Pd - Power Dissipation: 200mW; Id - Continuous Drain Current: 200mA; Forward Transconductance - Min: 0.1S; Manufacturer URL: http://www.diodes.com/; Series: BSS138; Package Description: 3-Pin Small Outline Transistor, Body 2 x 1.25 mm, Pitch 0.65 mm; Mounting Technology: SurfaceMount; Product Category: MOSFET; RoHS: True; Maximum Operating Temperature: +150C; Height: 1mm; Length: 2.2mm; Technology: Si; Width: 1.35mm; Datasheet URL: http://www.diodes.com/_files/datasheets/ds30206.pdf; Manufacturer: DiodesIncorporated; Package / Case: SOT-323-3; Typical Turn-On Delay Time: 20ns; Transistor Polarity: N-Channel; Factory Pack Quantity: 3000; Packaging: Reel; Product: MOSFETSmallSignal; Datasheet Version: Rev. 11-2, 09/2013; Package Reference: SOT323; Minimum Operating Temperature: -55C; Mounting Style: SMD/SMT; Channel Mode: Enhancement
R1-R4 R23 = CMP-009-00206-2: READ THE NAME
R22 = CMP-1012-00623-3: Chip Resistor, 10 KOhm, +/- 1%, 0.1 W, -55 to 155 degC, 0603 (1608 Metric), RoHS, Tape and Reel; Manufacturer: Panasonic; Voltage Rating: 75V; Case\/Package: 0603; Power Rating: 100mW; Resistance: 10KOhm; Temperature Coefficient: 100ppm\/degreesC; Number of Pins: 2; Package Reference: 603; Depth: 0.8mm; Mount: SurfaceMount; Package Description: 2-Pin Surface Mount Device, Body 1.6 x 0.85 mm; Datasheet Version: 02/2017; Length: 1.6mm; Lead Free: LeadFree; Height: 0.45mm; Number of Terminations: 2; Max Power Dissipation: 100mW; Min Operating Temperature: -55degC; Datasheet URL: https://industrial.panasonic.com/cdbs/www-data/pdf/RDA0000/AOA0000C304.pdf; Termination: SMD/SMT; Case Code (Metric): 1608; Case Code (Imperial): 0603; Tolerance: 1%; Max Operating Temperature: 155degC; RoHSCompliant: true; Voltage Rating (DC): 75V; Radiation Hardening: No; Packaging: TapeandReel; Composition: ThickFilm; Mounting Technology: SurfaceMount; Manufacturer URL: http://www.panasonic.com/; Width: 0.031inch; REACH SVHC: NoSVHC; Contact Plating: Tin; Military Standard: Not; Package Quantity: 1